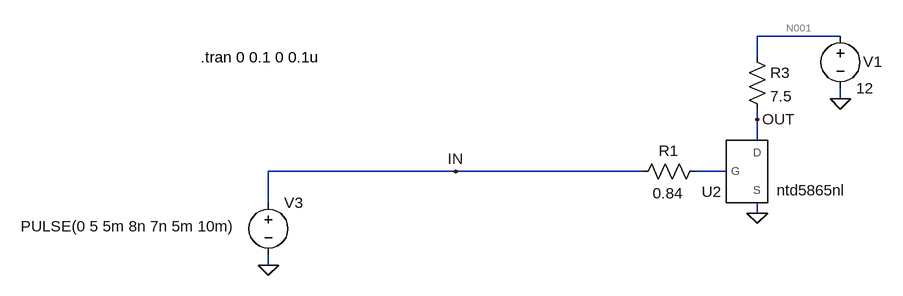
[diagram p0: schematic heater.asc]
heater.asc, the LTspice schematic file:
Version 4
SHEET 1 880 680
WIRE 384 -32 256 -32
WIRE 256 0 256 -32
WIRE 384 64 384 48
WIRE 256 96 256 80
WIRE 256 128 256 96
WIRE -208 176 -496 176
WIRE 80 176 -208 176
WIRE 208 176 160 176
WIRE -496 224 -496 176
WIRE 256 240 256 224
WIRE -496 320 -496 304
FLAG 256 240 0
FLAG 384 64 0
FLAG 256 96 OUT
FLAG -208 176 IN
FLAG -496 320 0
SYMBOL res 176 160 R90
WINDOW 0 0 56 VBottom 2
WINDOW 3 34 57 VTop 2
SYMATTR InstName R1
SYMATTR Value 0.84
SYMBOL res 240 -16 R0
SYMATTR InstName R3
SYMATTR Value 7.5
SYMBOL voltage 384 -48 R0
WINDOW 0 35 55 Left 2
WINDOW 123 0 0 Left 0
WINDOW 39 0 0 Left 0
SYMATTR InstName V1
SYMATTR Value 12
SYMBOL voltage -496 208 R0
WINDOW 3 -381 52 Left 2
WINDOW 123 0 0 Left 0
WINDOW 39 0 0 Left 0
SYMATTR Value PULSE(0 5 5m 8n 7n 5m 10m)
SYMATTR InstName V3
SYMBOL ntd5865nl 240 176 R0
WINDOW 0 -54 47 Bottom 2
WINDOW 3 99 13 Top 2
SYMATTR InstName U2
TEXT -600 0 Left 2 !.tran 0 0.1 0 0.1u

The netlist it stands for:
* heater.asc
R1 N002 IN 0.84
R3 N001 OUT 7.5
V1 N001 0 12
V3 IN 0 PULSE(0 5 5m 8n 7n 5m 10m)
XU2 OUT N002 0 ntd5865nl  ; pins D G S
.tran 0 0.1 0 0.1u
.lib C:\Users\Kyle\Documents\Storage\School\College\lambda-oxygen-sensor-interface\sim\lib\NTD5865NL\NTD5865NL.LIB
.backanno
.end

* Results of the author's LTspice run, read from the files saved beside the schematic
* Operating Point, zero values left out:
*   V(n001) = 12 V
*   V(out) = 12 V
*   I(R3) = 10.25 nA
*   I(R1) = 12 pA
*   I(V3) = 12 pA
*   I(V1) = -10.25 nA
*   Ix(u2:1) = 10.25 nA
*   Ix(u2:2) = -12 pA
*   Ix(u2:3) = -10.24 nA
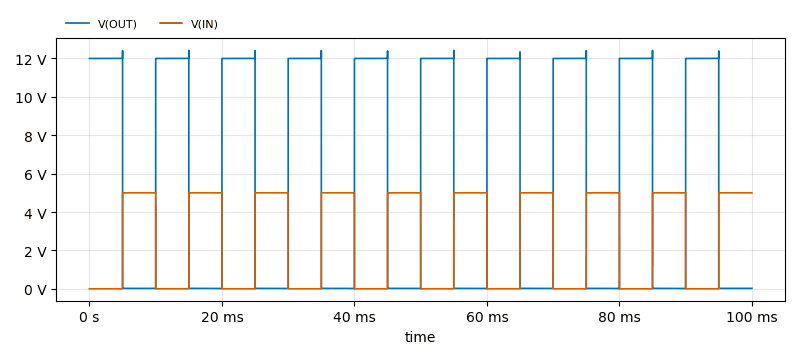
[diagram p1: Transient Analysis of heater.asc, plotted from the saved traces]
* Transient Analysis, 1 run:
*   V(OUT): min 15.09 mV, max 12.42 V, average 6.011 V, rms 8.485 V, last 22.75 mV
*   V(IN): min 0 V, max 5 V, average 2.5 V, rms 3.536 V, last 5 V